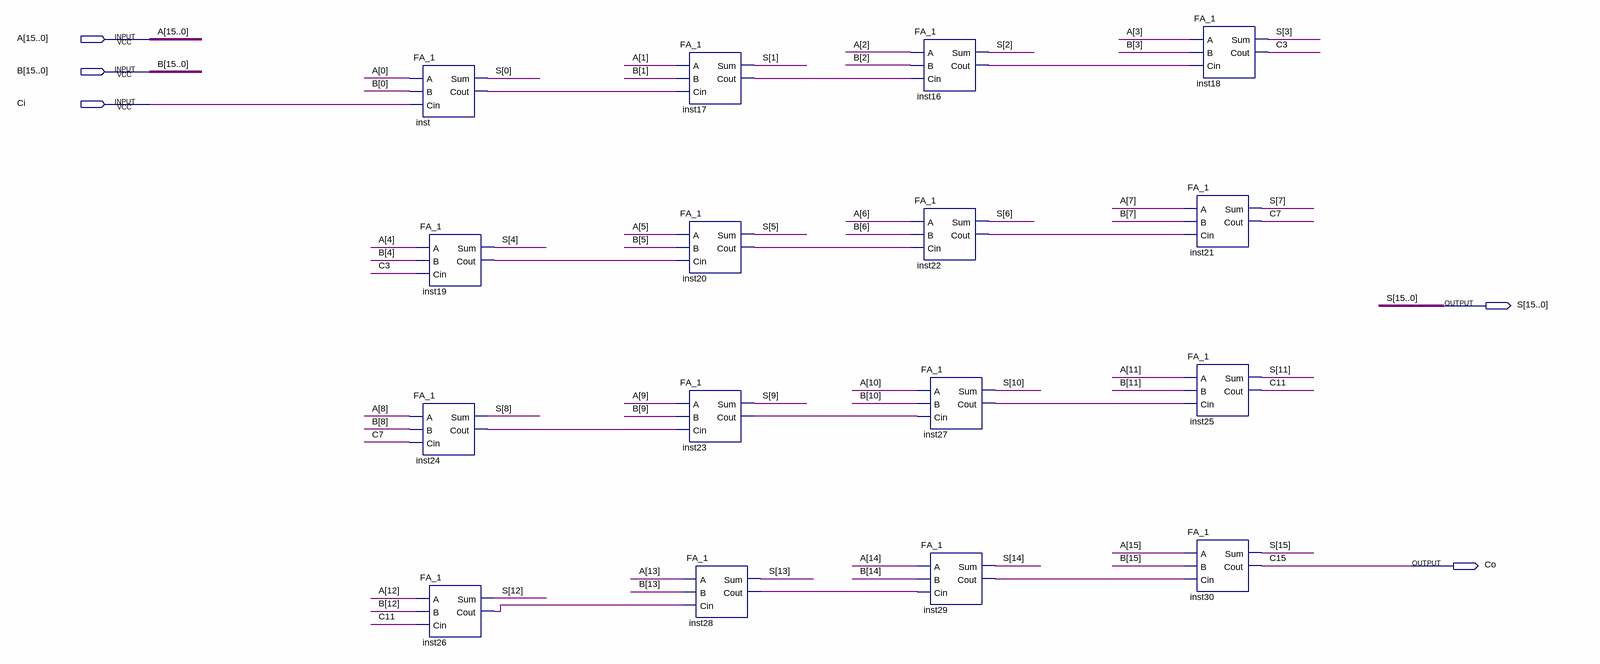
[diagram p0: schematic sheet]
// Quartus schematic FA16bit.bdf as structural Verilog: 16 symbols, 5 pins
module FA16bit (
  input  [15:0] A,
  input  [15:0] B,
  input  Ci,
  output [15:0] S,
  output Co
);

  wire C3, C7, C11, inst16_cout, inst17_cout, inst19_cout, inst20_cout, inst22_cout, inst23_cout,
       inst24_cout, inst26_cout, inst27_cout, inst28_cout, inst29_cout, inst_cout;

  FA_1 inst (.A(A[0]), .B(B[0]), .Cin(Ci), .Sum(S[0]), .Cout(inst_cout));
  FA_1 inst19 (.A(A[4]), .B(B[4]), .Cin(C3), .Sum(S[4]), .Cout(inst19_cout));
  FA_1 inst24 (.A(A[8]), .B(B[8]), .Cin(C7), .Sum(S[8]), .Cout(inst24_cout));
  FA_1 inst26 (.A(A[12]), .B(B[12]), .Cin(C11), .Sum(S[12]), .Cout(inst26_cout));
  FA_1 inst17 (.A(A[1]), .B(B[1]), .Cin(inst_cout), .Sum(S[1]), .Cout(inst17_cout));
  FA_1 inst20 (.A(A[5]), .B(B[5]), .Cin(inst19_cout), .Sum(S[5]), .Cout(inst20_cout));
  FA_1 inst23 (.A(A[9]), .B(B[9]), .Cin(inst24_cout), .Sum(S[9]), .Cout(inst23_cout));
  FA_1 inst28 (.A(A[13]), .B(B[13]), .Cin(inst26_cout), .Sum(S[13]), .Cout(inst28_cout));
  FA_1 inst16 (.A(A[2]), .B(B[2]), .Cin(inst17_cout), .Sum(S[2]), .Cout(inst16_cout));
  FA_1 inst22 (.A(A[6]), .B(B[6]), .Cin(inst20_cout), .Sum(S[6]), .Cout(inst22_cout));
  FA_1 inst27 (.A(A[10]), .B(B[10]), .Cin(inst23_cout), .Sum(S[10]), .Cout(inst27_cout));
  FA_1 inst29 (.A(A[14]), .B(B[14]), .Cin(inst28_cout), .Sum(S[14]), .Cout(inst29_cout));
  FA_1 inst18 (.A(A[3]), .B(B[3]), .Cin(inst16_cout), .Sum(S[3]), .Cout(C3));
  FA_1 inst21 (.A(A[7]), .B(B[7]), .Cin(inst22_cout), .Sum(S[7]), .Cout(C7));
  FA_1 inst25 (.A(A[11]), .B(B[11]), .Cin(inst27_cout), .Sum(S[11]), .Cout(C11));
  FA_1 inst30 (.A(A[15]), .B(B[15]), .Cin(inst29_cout), .Sum(S[15]), .Cout(Co));

  // Other names for the same wires on the sheet: C15 = Co
endmodule
